# EAGLE design DIAGONAL POLYPHONIC SEQUENCER SIMPLER VERSION v12 for JLC PCB OP AMP VERSION (EAGLE 9.6.2)
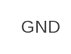
[diagram p0: schematic, sheet 1, part 1 of 2]
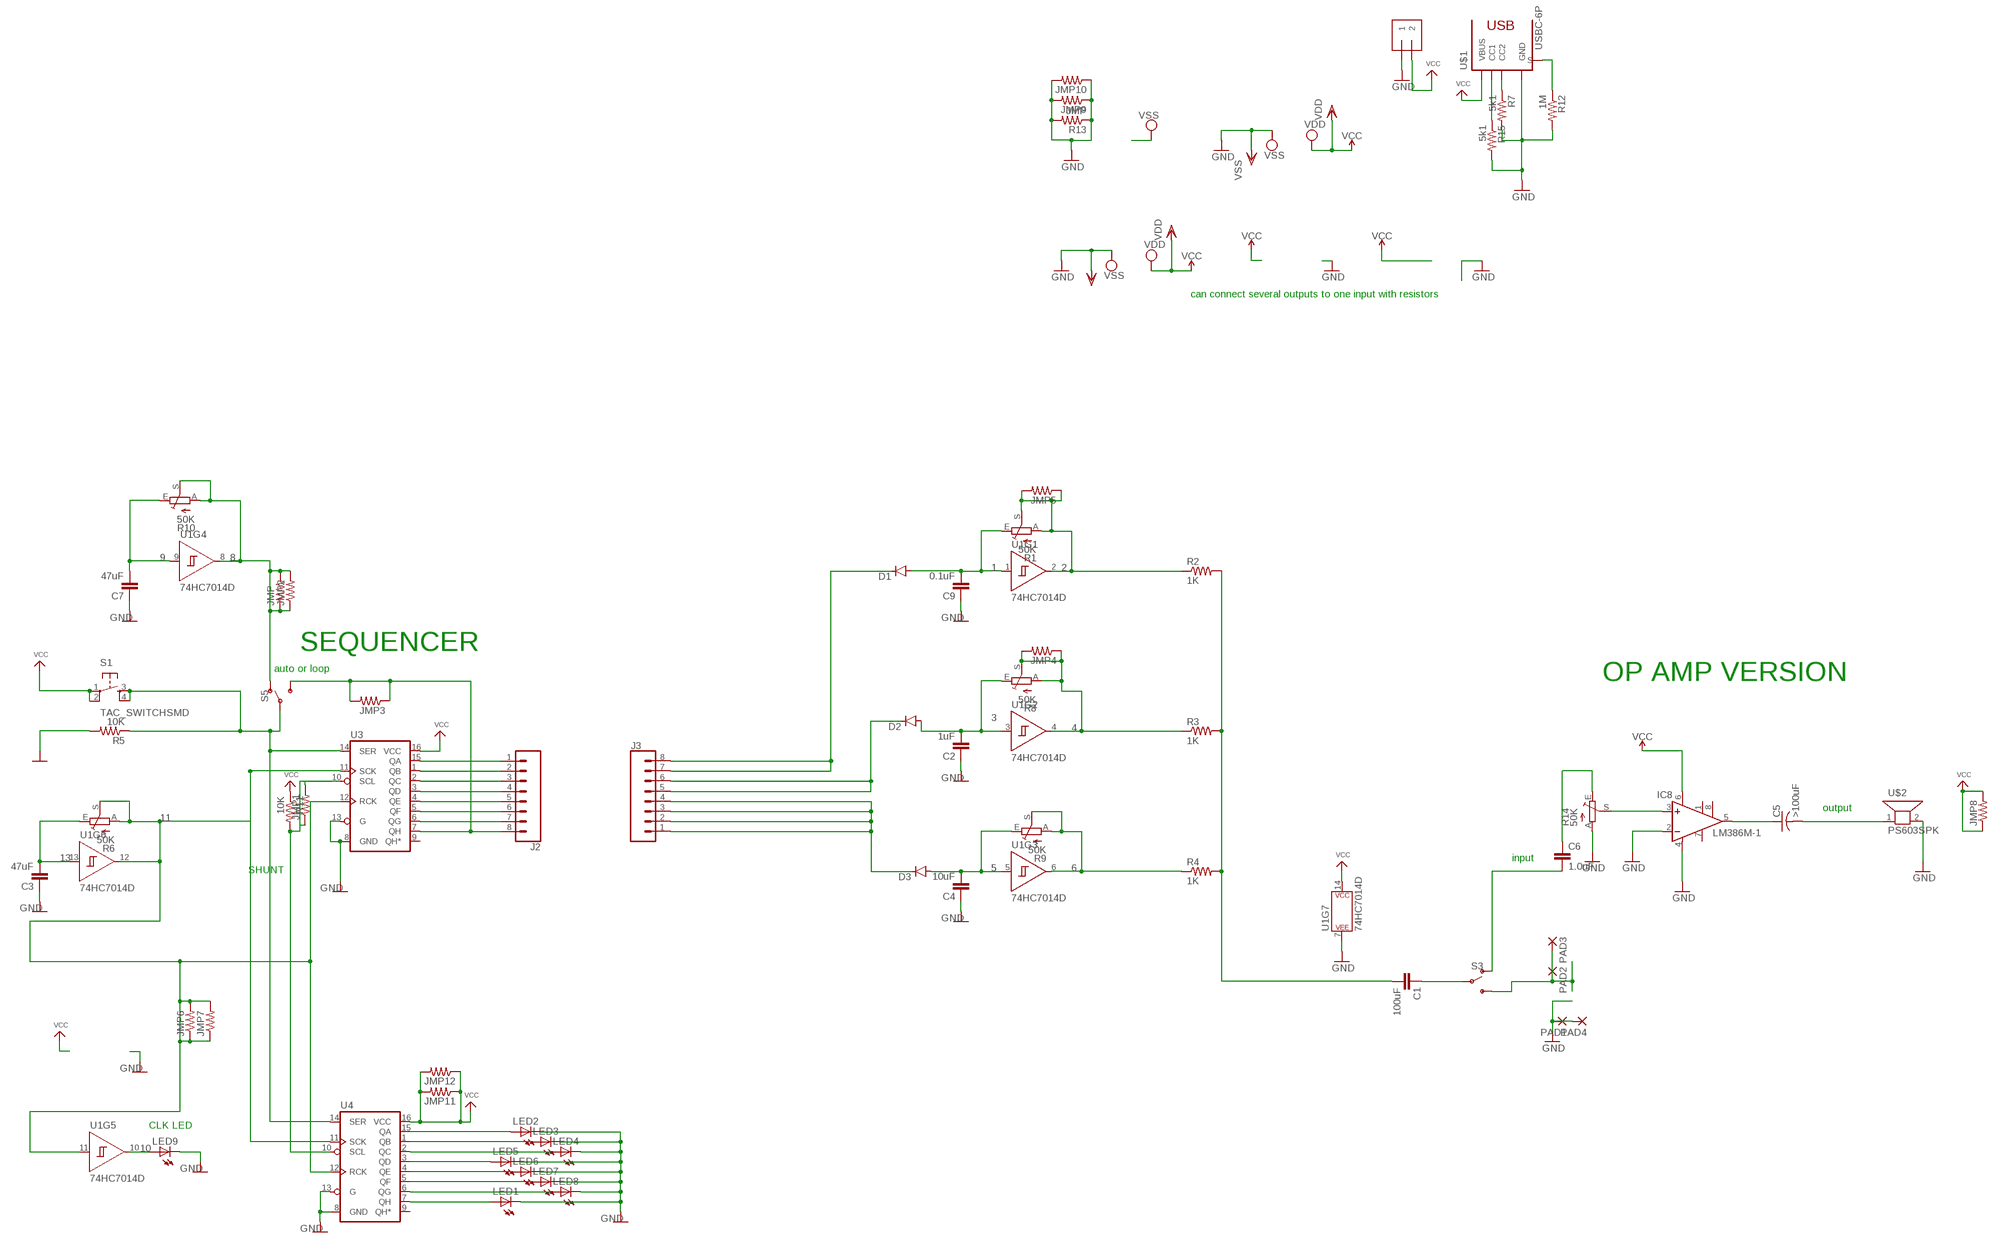
[diagram p1: schematic, sheet 1, part 2 of 2]

## Parts
C1  100uF  1.0UF-1206-50V-10%  [1206]
C2  1uF  1.0UF-1206-50V-10%  [1206]
C3  47uF  1.0UF-1206-50V-10%  [1206]
C4  10uF  1.0UF-1206-50V-10%  [1206]
C5  >100uF  C-USC1206  [C1206]
C6  1.0uF  1.0UF-1206-50V-10%  [1206]
C7  47uF  1.0UF-1206-50V-10%  [1206]
C9  0.1uF  1.0UF-1206-50V-10%  [1206]
D1  DIODEDO214AA  [DO-214AA]
D2  DIODEDO214AA  [DO-214AA]
D3  DIODEDO214AA  [DO-214AA]
IC8  LM386M-1  [SO08]
J1  1X2-3.5MM  [1X2-3.5MM]
J2  CONN_08SMD-STRAIGHT-ALT-FEMALE  [1X08_SMD_ALT]
J3  CONN_08SMD-STRAIGHT-ALT-FEMALE  [1X08_SMD_ALT]
JMP  R-US_R1206  [R1206]
JMP1  R-US_R1206  [R1206]
JMP2  R-US_R1206  [R1206]
JMP3  R-US_R1206  [R1206]
JMP4  R-US_R1206  [R1206]
JMP5  R-US_R1206  [R1206]
JMP6  R-US_R1206  [R1206]
JMP7  R-US_R1206  [R1206]
JMP8  R-US_R1206  [R1206]
JMP9  R-US_R1206  [R1206]
JMP10  R-US_R1206  [R1206]
JMP11  R-US_R1206  [R1206]
JMP12  R-US_R1206  [R1206]
LED1  LEDCHIPLED_1206  [CHIPLED_1206]
LED2  LEDCHIPLED_1206  [CHIPLED_1206]
LED3  LEDCHIPLED_1206  [CHIPLED_1206]
LED4  LEDCHIPLED_1206  [CHIPLED_1206]
LED5  LEDCHIPLED_1206  [CHIPLED_1206]
LED6  LEDCHIPLED_1206  [CHIPLED_1206]
LED7  LEDCHIPLED_1206  [CHIPLED_1206]
LED8  LEDCHIPLED_1206  [CHIPLED_1206]
LED9  LEDCHIPLED_1206  [CHIPLED_1206]
PAD1  SMD5  [SMD2,54-5,08]
PAD2  SMD5  [SMD2,54-5,08]
PAD3  SMD5  [SMD2,54-5,08]
PAD4  SMD5  [SMD2,54-5,08]
R1  50K  TRIM_EU-CA9V  [CA9V]
R2  1K  R-US_R1206  [R1206]
R3  1K  R-US_R1206  [R1206]
R4  1K  R-US_R1206  [R1206]
R5  10K  R-US_R1206  [R1206]
R6  50K  TRIM_EU-CA9V  [CA9V]
R7  5k1  R-US_R1206  [R1206]
R8  50K  TRIM_EU-CA9V  [CA9V]
R9  50K  TRIM_EU-CA9V  [CA9V]
R10  50K  TRIM_EU-CA9V  [CA9V]
R11  10K  R-US_R1206  [R1206]
R12  1M  R-US_R1206  [R1206]
R13  JMP  R-US_R1206  [R1206]
R14  50K  TRIM_EU-CA9V  [CA9V]
R15  5k1  R-US_R1206  [R1206]
S1  TAC_SWITCHSMD  [TACTILE-SWITCH-SMD]
S3  SWITCH-SPDT-SMD-AYZ0202  [SWITCH_DPDT_SMD_AYZ0202]
S5  SWITCH-SPDT-SMD-AYZ0202  [SWITCH_DPDT_SMD_AYZ0202]
U1  74HC7014D  [SO14]
U3  74595  [TSSOP16]
U4  74595  [TSSOP16]
U$1  USBC-6P  [USCX-06FX-XXMX-01]
U$2  PS603SPK  [PS603]

## Nets
1: C9.2 D1.A R1.E U1.1(A)
2: JMP5.1 JMP5.2 R1.A R1.S R2.1 U1.2(Y)
3: C2.2 D2.A R8.E U1.3(A)
4: JMP4.1 JMP4.2 R3.1 R8.A R8.S U1.4(Y)
5: C4.2 D3.A R9.E U1.5(A)
6: R4.1 R9.A R9.S U1.6(Y)
8: JMP2.1 JMP2.2 JMP.1 JMP.2 R10.A R10.S S5.1(O) U1.8(Y)
9: C7.2 R10.E U1.9(A)
10: LED9.A U1.10(Y)
11: JMP6.1 JMP6.2 JMP7.1 JMP7.2 R6.A R6.S U1.11(A) U1.12(Y) U3.11(SCK) U3.12(RCK) U4.11(SCK) U4.12(RCK)
13: C3.2 R6.E U1.13(A)
GND: C2.1 C3.1 C4.1 C7.1 C9.1 IC8.2(-IN) IC8.4(GND) J1.1 JMP9.1 JMP9.2 JMP10.1 JMP10.2 LED1.C LED2.C LED3.C LED4.C LED5.C LED6.C LED7.C LED8.C LED9.C PAD1.1(P) PAD4.1(P) R5.2 R7.2 R12.2 R13.1 R13.2 R14.A R15.2 U1.7(P$V-) U3.8(GND) U3.13(G) U4.8(GND) U4.13(G) U$1.GND1(GND) U$1.GND2(GND) U$2.2
N$1: LED1.A U4.7(QH)
N$2: C1.2 R2.2 R3.2 R4.2
N$3: LED4.A U4.2(QC)
N$4: R7.1 U$1.CC2
N$5: LED2.A U4.15(QA)
N$6: LED3.A U4.1(QB)
N$8: C1.1 S3.2(P)
N$9: J2.1 U3.15(QA)
N$10: J2.2 U3.1(QB)
N$11: LED7.A U4.5(QF)
N$12: LED6.A U4.4(QE)
N$13: LED8.A U4.6(QG)
N$14: LED5.A U4.3(QD)
N$15: D3.C J3.1 J3.2 J3.3 J3.4
N$16: D2.C J3.5 J3.6
N$17: R15.1 U$1.CC1
N$18: J2.3 U3.2(QC)
N$19: PAD2.1(P) PAD3.1(P) S3.3(S)
N$20: C6.2 S3.1(O)
N$21: J2.4 U3.3(QD)
N$22: R12.1 U$1.SHIELD1(S) U$1.SHIELD2(S) U$1.SHIELD3(S) U$1.SHIELD4(S)
N$24: D1.C J3.7 J3.8
N$25: J2.5 U3.4(QE)
N$26: J2.6 U3.5(QF)
N$27: J2.7 U3.6(QG)
N$28: J2.8 JMP3.1 JMP3.2 S5.3(S) U3.7(QH)
N$33: R5.1 S1.3 S1.4 S5.2(P) U3.14(SER) U4.14(SER)
N$45: JMP1.1 JMP1.2 R11.2 U3.10(SCL) U4.10(SCL)
N$99: IC8.3(+IN) R14.S
N$100: C5.1 IC8.5(OUT)
N$102: C5.2 U$2.1
N$103: C6.1 R14.E
VCC: IC8.6(VS) J1.2 JMP8.1 JMP8.2 JMP11.1 JMP11.2 JMP12.1 JMP12.2 R11.1 S1.1 S1.2 U1.14(P$V+) U3.16(VCC) U4.16(VCC) U$1.VBUS1(VBUS) U$1.VBUS2(VBUS)
Unconnected: IC8.1(GAIN) IC8.7(BYPASS) IC8.8(GAIN) U3.9(QH*) U4.9(QH*)

## Notes on the sheet
- can connect several outputs to one input with resistors
- SEQUENCER
- auto or loop
- OP AMP VERSION
- output
- input
- SHUNT
- CLK LED

## Library data of the parts
C1-C4 C7 C9 = SparkFun-Capacitors:1.0UF: 1µF ceramic capacitors A capacitor is a passive two-terminal electrical component used to store electrical energy temporarily in an electric field.; PROD_ID: CAP-09822; VALUE: 1.0uF
C5 = adafruit:C-US: CAPACITOR, American symbol
C6 = SparkFun-Capacitors:1.0UF: 1µF ceramic capacitors A capacitor is a passive two-terminal electrical component used to store electrical energy temporarily in an electric field.; PROD_ID: CAP-09822
D1-D3 = BeagleBone_Blue_R3:DIODE: Diode These are standard reverse protection diodes and small signal diodes. SMA package can handle up to about 1A. SOD-323 can handle about 200mA. What the SOD-323 package when ordering, there are some mfgs out there that are 5-pin packages.
IC8 = linear:LM386?-*: Low Voltage Audio Power Amplifier Source: http://cache.national.com/ds/LM/LM386.pdf
J1 = adafruit:1X2: 3.5mm Terminal block http://www.ladyada.net/library/pcb/eaglelibrary.html
J2 J3 = SparkFun-Connectors:CONN_08: Multi connection point. Often used as Generic Header-pin footprint for 0.1 inch spaced/style header connections On any of the 0.1 inch spaced packages, you can populate with these: Break Away Headers - Straight <https://www.sparkfun.com/products/116> (PRT-00116) Break Away Male Headers - Right Angle <https://www.sparkfun.com/products/553> (PRT-00553) Female Headers <https://www.sparkfun.com/products/115> (PRT-00115) Break Away Headers - Machine Pin <https://www.sparkfun.com/products/117> (PRT-00117) Break Away Female Headers - Swiss Machine Pin <https://www.sparkfun.com/products/743> (PRT-00743) Arduino Stackable Header - 8 Pin <https://www.sparkfun.com/products/9279> (PRT-09279) For SCREWTERMINALS and SPRING TERMINALS visit here: Screw Terimnals on SparkFun.com <https://www.sparkfun.com/search/results?term=Screw+Terminals> (5mm/3.5mm/2.54mm spacing) This device is also useful as a general connection point to wire up your design to another part of your project. Our various solder wires solder well into these plated through hole pads. Hook-Up Wire - Assortment (Stranded, 22 AWG) <https://www.sparkfun.com/products/11375> (PRT-11375) Hook-Up Wire - Assortment (Solid Core, 22 AWG) <https://www.sparkfun.com/products/11367> (PRT-11367) View the entire wire category on our website here <https://www.sparkfun.com/categories/141> Special notes: Molex polarized connector foot print use with SKU : PRT-08231 with associated crimp pins and housings. 1MM SMD Version SKU: PRT-10208 NOTES ON THE VARIANTS LOCK and LOCK_LONGPADS... This footprint was designed to help hold the alignment of a through-hole component (i.e. 6-pin header) while soldering it into place. You may notice that each hole has been shifted either up or down by 0.005 of an inch from it's more standard position (which is a perfectly straight line). This slight alteration caused the pins (the squares in the middle) to touch the edges of the holes. Because they are alternating, it causes a "brace" to hold the component in place. 0.005 has proven to be the perfect amount of "off-center" position when using our standard breakaway headers. Although looks a little odd when you look at the bare footprint, once you have a header in there, the alteration is very hard to notice. Also,if you push a header all the way into place, it is covered up entirely on the bottom side.; PROD_ID: CONN-10204; SF_ID: PRT-11543
JMP JMP1-JMP12 R2-R5 R7 R11-R13 R15 = adafruit:R-US_: RESISTOR, American symbol
LED1-LED9 = adafruit:LED: LED OSRAM: - CHIPLED LG R971, LG N971, LY N971, LG Q971, LY Q971, LO R971, LY R971 LH N974, LH R974 LS Q976, LO Q976, LY Q976 LO Q996 - Hyper CHIPLED LW Q18S LB Q993, LB Q99A, LB R99A - SideLED LS A670, LO A670, LY A670, LG A670, LP A670 LB A673, LV A673, LT A673, LW A673 LH A674 LY A675 LS A676, LA A676, LO A676, LY A676, LW A676 LS A679, LY A679, LG A679 - Hyper Micro SIDELED® LS Y876, LA Y876, LO Y876, LY Y876 LT Y87S - SmartLED LW L88C, LW L88S LB L89C, LB L89S, LG L890 LS L89K, LO L89K, LY L89K LS L896, LA L896, LO L896, LY L896 - TOPLED LS T670, LO T670, LY T670, LG T670, LP T670 LSG T670, LSP T670, LSY T670, LOP T670, LYG T670 LG T671, LOG T671, LSG T671 LB T673, LV T673, LT T673, LW T673 LH T674 LS T676, LA T676, LO T676, LY T676, LB T676, LH T676, LSB T676, LW T676 LB T67C, LV T67C, LT T67C, LS T67K, LO T67K, LY T67K, LW E67C LS E67B, LA E67B, LO E67B, LY E67B, LB E67C, LV E67C, LT E67C LW T67C LS T679, LY T679, LG T679 LS T770, LO T770, LY T770, LG T770, LP T770 LB T773, LV T773, LT T773, LW T773 LH T774 LS E675, LA E675, LY E675, LS T675 LS T776, LA T776, LO T776, LY T776, LB T776 LHGB T686 LT T68C, LB T68C - Hyper Mini TOPLED® LB M676 - Mini TOPLED Santana® LG M470 LS M47K, LO M47K, LY M47K Source: http://www.osram.convergy.de/
PAD1-PAD4 = wirepad:SMD5: SMD PAD
R1 R6 R8-R10 R14 = pot:TRIM_EU-: POTENTIOMETER
S1 = SparkFun-Retired:TAC_SWITCH: Momentary Switch Button commonly used for reset or general input. Spark Fun Electronics SKU : COM-00097 SMT- SWCH-08247; PROD_ID: SWCH-08247
S3 S5 = SparkFun-Switches:SWITCH-SPDT: Single Pole, Double Throw (SPDT) Switch Single-pole, double-throw (SPDT) switch. Variant Overview SMD-AYZ0202 Surface Mount DPDT Switch <https://www.sparkfun.com/products/597> (COM-00597) Used on e.g. LilyPad Arduino USB - ATmega32U4 Board <https://www.sparkfun.com/products/12049> PTH-11.6X4.0MM SPDT Mini Power Switch <https://www.sparkfun.com/products/102> (COM-00102) Used on e.g. SparkFun Simon Says - Through-Hole Soldering Kit <https://www.sparkfun.com/products/10547> (KIT-10547) PTH-11.6X4.0MM-KIT KIT version of SPDT Mini Power Switch - Simplifies soldering by removing tStop of switch pins - only one side can be soldered. PTH-11.6X4.0MM-LOCK LOCK version of SPDT Mini Power Switch - Offset pins hold switch in place for easier soldering. SMD-RIGHT-ANGLE Surface Mount Right Angle Switch <https://www.sparkfun.com/products/10860> (COM-10860) Used on e.g. SparkFun ESP8266 Thing <https://www.sparkfun.com/products/13231>; PROD_ID: SWCH-08179; SF_ID: COM-00597
U1 = SparkFun-IC-Logic:74*7014: Schmitt-trigger Hex Buffer The 74HC7014 is a hex buffer with precision Schmitt-trigger inputs. The precisely defined trigger levels are lying in a window between (0.55 x VCC) and (0.65 x VCC). It makes the circuit suitable to operate in a highly noisy environment. Input shorts are allowed to -1.5 V and +16 V without disturbing other channels. Inputs include clamp diodes that enable the use of current limiting resistors to interface inputs to voltages in excess of VCC. Schmitt trigger inputs transform slowly changing input signals into sharply defined jitter-free output signals. SparkFun Products SparkFun Stepoko <https://www.sparkfun.com/products/13899> (ROB-13899); PROD_ID: IC-12527
U3 U4 = SparkFun-IC-Logic:74*595: 8-Bit Shift Register (Serial to Parallel) Datasheet <http://cdn.sparkfun.com/datasheets/BreakoutBoards/MM74HC595.pdf> SparkFun Products SparkFun Shift Register Breakout - 74HC595 <https://www.sparkfun.com/products/10680> (BOB-10680)
U$1 = USBC6P:USBC-6P: AliExpress Special! Connect 5.1k 10% resistors to each CC pin, pulled up to 3.3v or 5.0v.
U$2 = adafruit:PS603: PS603 Small 8 ohm speaker, from Mouser. Can SMT solder to board http://www.ladyada.net/library/pcb/eaglelibrary.html

## Board
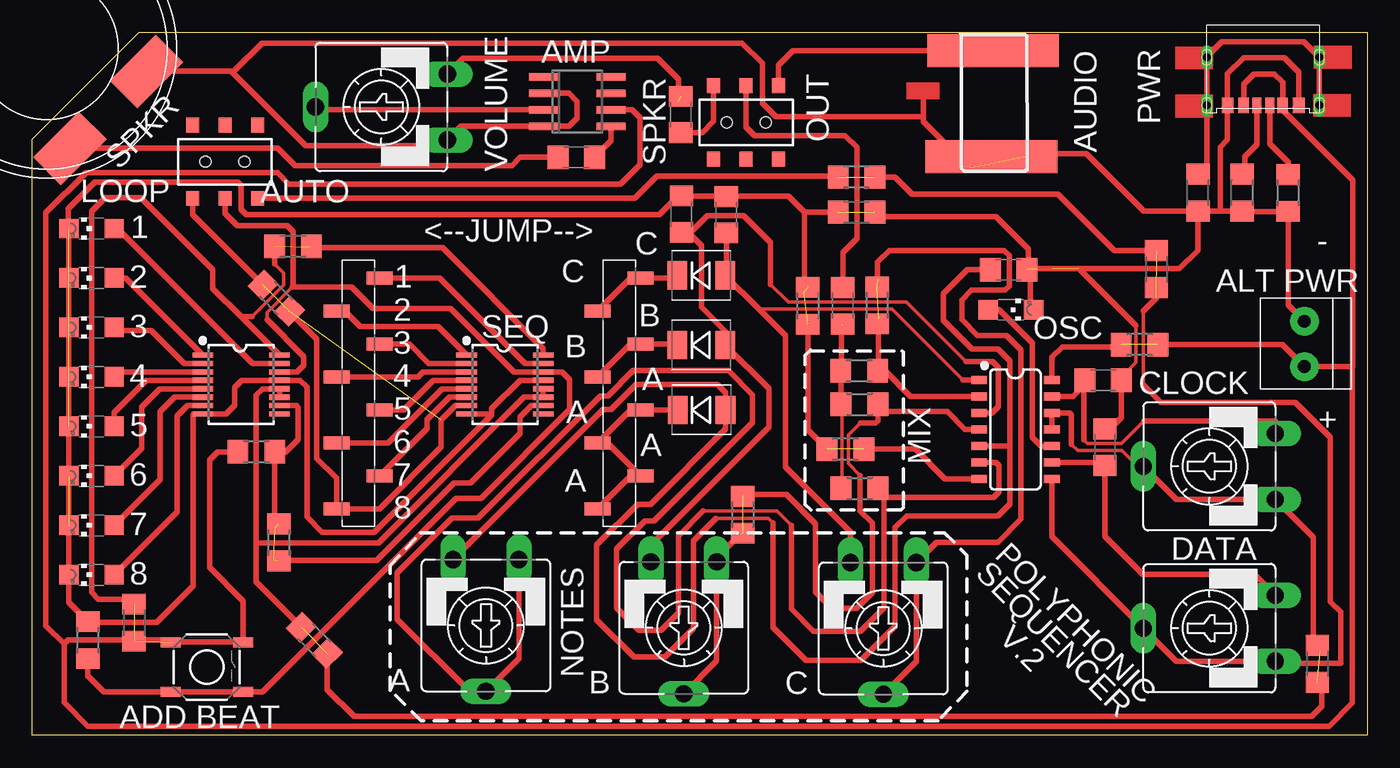
[diagram p2: board, top side]

Size 102.79 x 54.15 mm. Coordinates in mm from the lower left corner, seen from the top.
Outline: 0,45.95 8.2,54.15 8.25,54.15 102.79,54.15 102.79,0 0.03,0 0,0 0,45.95
Copper layers (1*16): Top 0.035mm / dielectric 0.2mm / Bottom 0.035mm
Design rules "JLC PCB DRU": minimum track width 3.5mil, minimum drill 0.2mm, track to track 3.5mil, track to pad 5mil, pad to pad 5mil, via to via 5mil, smd to smd 0mil, copper to edge 0.1mm, drill to drill 5mil, minimum pad ring 4mil, minimum via ring 4mil, stop-mask expansion 3mil, vias tented up to drill 100mil, thermal gap 10mil

### Footprints (pad centres in the part's own frame; a part is rotated, then mirrored left to right if it is on the bottom)
1206 = smd 1.6 x 1.8: 1 -1.4,0; 2 1.4,0
C1206 = smd 1.6 x 1.8: 1 -1.4,0; 2 1.4,0
DO-214AA = smd 1.524 x 2.184: A 1.841,0; C -1.841,0
SO08 = smd 0.6 x 2.2: 1 -1.905,-2.6; 2 -0.635,-2.6; 3 0.635,-2.6; 4 1.905,-2.6; 5 1.905,2.6; 6 0.635,2.6; 7 -0.635,2.6; 8 -1.905,2.6
1X2-3.5MM = drill 1 pad 2.184: 1 1.8,0; 2 -1.7,0
1X08_SMD_ALT = smd 1 x 2: 1 0,-1.65; 2 -2.54,1.65; 3 -5.08,-1.65; 4 -7.62,1.65; 5 -10.16,-1.65; 6 -12.7,1.65; 7 -15.24,-1.65; 8 -17.78,1.65
R1206 = smd 1.6 x 1.803: 1 -1.422,0; 2 1.422,0
CHIPLED_1206 = smd 1.5 x 1.5: A 0,-1.75; C 0,1.75
SMD2,54-5,08 = smd 2.54 x 5.08: 1 0,0
CA9V = drill 1.321 long: A -2.54,-5.08; E 2.54,-5.08; S 0,5.08
TACTILE-SWITCH-SMD = smd 1.524 x 0.762: 1 -2.794,1.905; 2 2.794,1.905; 3 -2.794,-1.905; 4 2.794,-1.905
SWITCH_DPDT_SMD_AYZ0202 = smd 1 x 1.15: 1 -2.5,2.825; 2 0,2.825; 3 2.5,2.825; 4 -2.5,-2.825; 5 0,-2.825; 6 2.5,-2.825 | hole 0.85: 1.5,0; -1.5,0
SO14 = smd 0.6 x 1.2: 1 -3.175,-2.8; 2 -1.905,-2.8; 3 -0.635,-2.8; 4 0.635,-2.8; 5 1.905,-2.8; 6 3.175,-2.8; 7 4.445,-2.8; 8 4.445,2.8; 9 3.175,2.8; 10 1.905,2.8; 11 0.635,2.8; 12 -0.635,2.8; 13 -1.905,2.8; 14 -3.175,2.8
TSSOP16 = smd 0.4 x 1.6: 1 -2.225,-2.85; 2 -1.575,-2.85; 3 -0.925,-2.85; 4 -0.275,-2.85; 5 0.375,-2.85; 6 1.025,-2.85; 7 1.675,-2.85; 8 2.325,-2.85; 9 2.325,3.05; 10 1.675,3.05; 11 1.025,3.05; 12 0.375,3.05; 13 -0.275,3.05; 14 -0.925,3.05; 15 -1.575,3.05; 16 -2.225,3.05
USCX-06FX-XXMX-01 = smd 0.7 x 1.2: CC1 0.5,-1.75; CC2 -0.5,-1.75 | smd 0.9 x 1.2: GND1 2.75,-1.75; GND2 -2.75,-1.75 | drill 0.6 long: SHIELD1 4.325,1.95; SHIELD2 4.325,-1.75; SHIELD3 -4.35,-1.75; SHIELD4 -4.35,1.95 | smd 0.8 x 1.2: VBUS1 1.5,-1.75; VBUS2 -1.5,-1.75
PS603 = smd 5 x 3: 1 -4.184,-6.738; 2 4.184,-6.738

### Placement (x,y rotation side)
C1  62.41,33.1 270 top
C2  49.99,40.16 270 top
C3  82.47,27.37 180 top
C4  75.18,35.86 180 top
C5  41.88,44.53 180 top
C6  49.94,47.83 270 top
C7  82.6,22.2 270 top
C9  53.44,40.11 270 top
D1  51.51,35.43 0 top
D2  51.51,30.07 0 top
D3  51.54,25.07 0 top
IC8  41.96,48.82 270 top
J1  97.97,30.1 90 top
J2  25.1,35.23 90 top
J3  45.19,17.45 270 top
JMP  63.47,43 0 top
JMP1  18.97,14.86 90 top
JMP2  86.56,35.92 90 top
JMP3  18.78,33.69 135 top
JMP4  54.71,16.99 90 top
JMP5  65.05,33.12 90 top
JMP6  21.7,7.32 135 top
JMP7  98.96,5.51 90 top
JMP8  85.27,30.1 0 top
JMP9  59.72,33.1 90 top
JMP10  62.61,22.05 0 top
JMP11  20.07,37.67 0 top
JMP12  7.82,8.69 90 top
LED1  4.55,12.37 90 top
LED2  4.55,39.04 90 top
LED3  4.55,35.23 90 top
LED4  4.55,31.42 90 top
LED5  4.55,27.61 90 top
LED6  4.55,23.8 90 top
LED7  4.55,19.99 90 top
LED8  4.55,16.18 90 top
LED9  75.36,32.79 270 top
PAD1  76.4,44.6 90 top
PAD2  76.5,52.73 90 top
PAD3  71.48,52.73 90 top
PAD4  71.32,44.6 270 top
R1  65.53,8.23 180 top
R2  63.68,28.09 180 top
R3  63.7,25.5 180 top
R4  63.7,19.02 180 top
R5  4.27,7.34 90 top
R6  90.65,20.73 90 top
R7  93.17,41.81 270 top
R8  50.16,8.28 180 top
R9  34.93,8.46 180 top
R10  90.65,8.26 90 top
R11  17.25,21.84 0 top
R12  89.76,41.81 270 top
R13  63.47,40.31 180 top
R14  26.87,48.41 90 top
R15  96.72,41.78 270 top
S1  13.44,5.26 0 top
S3  54.97,47.22 0 top
S5  14.83,44.2 180 top
U1  75.72,24.21 270 top
U3  36.3,27.08 270 top
U4  15.98,27.08 270 top
U$1  94.79,50.29 0 top
U$2  1.07,52.96 45 top

### Tracks (layer width: path | path; a pad name or v marks a point on that pad's centre or on a via)
1  (1 unrouted)
  Top 0.254: 66.22,32.84 55.94,32.84 | 71.67,27.38 66.22,32.84
  Top 0.406: R1.E 62.99,15.67 57.99,20.68 57.99,30.8 55.94,32.84 D1.A 53.44,35.52 C9.2 | U1.1 71.67,27.38
2  (2 unrouted)
  Top 0.406: R1.S 68.07,5.69 R1.A 69.62,14.86 74.35,14.86 76.15,16.66 76.15,29.67 75.01,30.81 72.8,30.81 71.58,32.03 71.58,33.53 72.34,34.29 74.9,34.29 75.23,34.62 75.23,36.96 74.83,37.36 65.99,37.36 65.07,36.45 65.07,35.15 | 65.15,31.67 65.15,28.09 R2.1 65.65,28.09 67.63,26.11 U1.2 | 65.15,31.67 65.15,31.98 65.2,32.03 | JMP5.1 65.13,31.7 65.15,31.67
3
  Top 0.254: 71.88,28.8 67.31,33.38 58.22,33.38 56.85,34.75
  Top 0.406: R8.E 47.62,11.94 47.73,11.84 47.73,14.76 56.72,23.75 56.72,26.71 D2.A 53.35,31.17 51.54,32.98 51.54,37.72 50.67,38.58 50.16,38.58 | 50.16,38.58 50.34,38.4 51.99,40.06 54.76,40.06 56.85,37.97 56.85,34.75 | 50.16,38.58 C2.2 | 71.88,28.8 73.94,28.8 74.4,28.35 74.4,25.35 73.89,24.84 U1.3
4  (3 unrouted)
  Top 0.254: 63.75,20.04 62.86,20.93 62.86,23.14 63.78,24.05
  Top 0.406: R8.S 52.7,5.74 R8.A 52.7,13.67 54.51,15.47 | R3.1 65.68,24.94 70.46,24.94 71.83,23.57 U1.4 | R3.1 64.64,25.5 | 54.66,18.54 58.09,18.54 60.32,16.31 60.32,11.05 61.59,9.78 63.47,9.78 64.69,11 64.69,16.36 63.75,17.3 63.75,20.04 | R3.1 65.13,24.23 64.95,24.05 63.78,24.05
5
  Top 0.254: 52.65,16.71 56.69,16.71 57.05,16.36
  Top 0.406: 52.65,16.71 50.9,14.96 50.9,8.23 48.72,6.05 46.33,6.05 43.46,8.92 43.46,14.66 46.61,17.81 47.6,17.81 53.38,23.58 D3.A 53.38,26.43 52.78,27.03 46.51,27.03 44.58,25.1 43.94,25.1 R9.E | 57.05,16.36 57.05,8.31 59.56,5.79 63.8,5.79 66.42,8.41 66.42,16 67.34,16.92 74.37,16.92 75.29,17.83 75.29,22.28 | C4.2 72.01,35.86 70.18,34.04 70.18,31.95 72.36,29.77 74.35,29.77 75.29,28.83 75.29,22.28 | 75.29,22.28 72.94,22.28 U1.5
6
  Top 0.254: 58.45,16.18 57.35,17.27 51.66,17.27
  Top 0.406: R9.A 37.46,5.92 R9.S 33.65,3.38 28.09,8.94 28.09,12.52 32.33,16.76 34.34,16.76 43.74,26.16 44.32,26.16 46.25,28.09 53.59,28.09 55.45,26.24 55.45,24.1 47.88,16.54 47.17,16.54 44.98,14.35 44.98,9.83 46.74,8.08 48.41,8.08 49.76,9.42 49.76,15.37 51.66,17.27 | 58.45,16.18 58.45,9.73 60.17,8 63.78,8 65.58,9.8 65.58,19.02 R4.1 65.84,18.31 74.02,18.31 74.45,18.75 74.45,20.78 74.19,21.03 U1.6
8  (4 unrouted)
  Top 0.254: 85.55,32.69 85.55,28.4 | 85.55,27.01 85.55,28.4
  Top 0.406: R10.S 88.11,5.72 R10.A 95.88,5.56 100.76,5.56 100.76,9.5 99.97,10.29 99.97,22.94 97.26,25.65 86.91,25.65 85.55,27.01 | 85.01,8.89 85.01,8.81 R10.S | 61.75,43.31 JMP.1 61.98,43.08 48.11,43.08 46.4,41.37 S5.1 | JMP.2 66.42,43 67.74,41.68 78.97,41.68 83.31,37.34 JMP2.2 | 86.61,37.57 86.61,37.16 | JMP2.1 86.56,33.71 85.55,32.69 | U1.8 78.52,15.31 R10.S
9
  Top 0.406: R10.E 94.13,12.4 85.52,12.4 82.6,15.32 C7.2 82.37,21.03 U1.9
10
  Top 0.406: LED9.A 74.45,32.79 77.01,30.23 77.01,22.94 77.7,22.25 78.47,22.25 U1.10
11  (3 unrouted)
  Top 0.254: 85.14,20.73 83.92,21.95 80.52,21.95 80.04,22.43
  Top 0.406: U3.12 U3.11 37.86,26.05 26.64,14.83 17.35,14.83 17.25,14.94 | 17.25,14.94 17.25,26.21 17.74,26.7 U4.12 U4.11 | 85.14,20.73 R6.S 88.11,18.19 R6.A 98.65,15.27 98.65,7.24 JMP7.2 99.19,6.71 99.19,6.48 | 17.25,14.94 17.25,11.81 20.9,8.15 | JMP6.1 22.71,3.52 24.78,1.45 98.53,1.45 99.31,2.24 99.31,3.73 JMP7.1 | 80.04,22.43 80.04,24.66 79.86,24.84 U1.12 U1.11
13
  Top 0.254: 80.98,22.76 81.25,22.48 83.87,22.48 85.6,24.21
  Top 0.406: 80.98,22.76 80.98,27.27 C3.2 81.07,27.06 80.12,26.11 U1.13 | 85.6,24.21 95.73,24.21 R6.E
GND  (11 unrouted)
  Top 0.254: 84.99,31.57 84.99,28.74 83.87,27.62
  Top 0.406: U3.8 35.36,24.75 | 35.36,24.75 35.36,25.17 37.54,27.36 U3.13 | U$1.GND1 97.54,51.1 96.42,52.22 93.29,52.22 92.04,50.97 U$1.GND2 92.04,45.88 91.48,45.32 91.48,40.39 | R12.2 91.48,40.39 | 91.48,40.39 R7.2 93.19,40.36 R15.2 96.72,33.14 J1.1 | 35.36,24.75 35.36,24.69 26.31,15.65 22.33,15.65 21.16,16.81 21.16,26.82 20.63,27.35 U4.13 16.12,27.35 15.57,26.8 15.57,25.4 14.92,24.75 U4.8 12.41,24.75 12.37,24.71 12.37,11.51 9.55,8.69 4.34,8.69 R5.2 4.27,8.79 2.8,10.26 LED1.C LED8.C LED2.C 2.77,39.07 2.77,40.59 4.8,42.62 15.82,42.62 16.08,42.37 16.08,40.51 16.45,40.14 48.29,40.14 49.71,41.56 C2.1 | C2.1 53.39,41.56 | 53.39,41.56 53.64,41.56 53.67,41.53 58.24,41.53 59.46,40.31 | 53.39,41.56 C9.1 | C7.1 82.98,23.6 83.87,24.49 C3.1 83.87,27.62 | PAD4.1 73.15,44.6 73.36,44.81 81.18,44.81 85.6,40.39 R12.2 | 84.99,31.57 80.59,35.97 | R12.2 89.76,37.36 88.34,35.94 76.66,35.94 C4.1 76.71,35.74 | PAD4.1 72.19,43.74 | R13.1 65.25,39.95 74.22,39.95 76.71,37.46 76.71,35.74 | 50.06,41.63 C2.1 | LED9.C 76.86,33.05 76.86,35.59 76.71,35.74 | R13.2 59.46,40.31 | 59.46,40.31 59.46,34.16 59.44,34.14 | JMP10.1 59.72,23.52 JMP9.1 | U1.7 70.28,19.76 68,22.05 JMP10.2 | PAD4.1 68.63,47.29 68.63,47.63 | 68.63,47.63 68.63,49.43 | U$2.2 15.32,51.15 | 15.32,51.15 21.06,45.42 31.5,45.42 R14.A 32.99,46.91 IC8.4 41.33,46.91 41.96,47.55 41.96,48.82 41.33,49.45 IC8.2 | 15.32,51.15 15.52,51.15 17.7,53.34 54.66,53.34 56.24,51.77 56.24,48.72 57.28,47.68 68.58,47.68 68.63,47.63
N$1
  Top 0.406: LED1.A 11.15,17.22 11.15,24.61 11.94,25.4 U4.7
N$2  (1 unrouted)
  Top 0.254: 62.36,25.43 62.36,19.1
  Top 0.406: 62.36,25.43 R3.2 62.26,25.53 R2.2 62.31,28.14 62.31,31.6 | 62.36,19.1 R4.2
N$3
  Top 0.406: U4.2 11.68,28.65 9.14,31.19 6.52,31.19 LED4.A
N$4
  Top 0.406: U$1.CC2 94.32,48.52 94.32,45.52 93.4,44.6 93.4,43.46 R7.1
N$5
  Top 0.406: U4.15 16.94,28.65 6.55,39.04 LED2.A
N$6
  Top 0.406: LED3.A 7.2,35.23 U4.1
N$8
  Top 0.406: C1.1 62.41,37.19 63.49,38.27 63.49,45.3 62.59,46.2 55.63,46.2 54.97,46.86 S3.2
N$9
  Top 0.406: U3.15 37.95,28.65 31.37,35.23 J2.1
N$10
  Top 0.406: J2.2 24.05,32.69 25.25,31.5 31.25,31.5 U3.1
N$11
  Top 0.406: LED7.A 8.41,22.1 8.41,25.3 9.8,26.7 U4.5
N$12
  Top 0.406: U4.4 8.76,27.35 6.3,24.89 LED6.A
N$13
  Top 0.406: LED8.A 9.83,19.71 9.83,24.94 10.94,26.05 U4.6
N$14
  Top 0.406: U4.3 6.69,28 LED5.A
N$15
  Top 0.406: D3.C J3.4 46.08,25.07 J3.3 44.3,22.53 J3.2 46.08,19.99 J3.1
N$16
  Top 0.406: J3.5 46.08,30.15 J3.6 49.59,30.15 D2.C
N$17
  Top 0.406: R15.1 96.72,44.17 95.32,45.58 95.32,48.52 U$1.CC1
N$18
  Top 0.406: J2.3 29.03,30.15 30.53,28.65 U3.2
N$19
  Top 0.406: PAD2.1 PAD3.1 58.58,52.73 57.47,51.61 S3.3
N$20
  Top 0.406: C6.2 51.59,46.43 52.47,47.3 S3.1
N$21
  Top 0.406: J2.4 29.69,27.61 30.08,28 U3.3
N$22
  Top 0.406: R12.1 90.47,43.94 90.47,48.52 U$1.SHIELD3 U$1.SHIELD4 90.44,52.29 91.59,53.44 97.92,53.44 U$1.SHIELD1 U$1.SHIELD2
N$23
  Top 0.406: 20.09,32.26 20.17,32.26 21.89,30.53 21.89,21.34 23.42,19.81 23.42,17.45
N$24
  Top 0.406: D1.C 49.47,35.23 J3.8 46.08,35.23 J3.7
N$25
  Top 0.406: J2.5 28.57,25.07 30.86,27.35 U3.4
N$26
  Top 0.406: J2.6 27.38,22.53 31.55,26.7 U3.5
N$27
  Top 0.406: J2.7 30.4,23.65 30.4,24.34 32.11,26.05 U3.6
N$28  (2 unrouted)
  Top 0.406: J2.8 26.72,17.45 31.47,22.2 31.47,24.28 32.59,25.4 U3.7 | S5.3 12.33,40.14 JMP3.2
N$33
  Top 0.254: 18.06,32.03 18.06,32.59 20.02,34.54 20.07,34.59
  Top 0.406: U4.14 20.4,28 20.91,28.51 20.91,29.18 18.06,32.03 | 20.07,34.59 20.07,38.81 19.61,39.27 15.75,39.27 14.83,40.18 S5.2 | R5.1 4.27,4.57 5.49,3.35 S1.3 S1.4 17.73,3.35 32.64,18.26 34.54,18.26 41.38,25.1 41.38,27.43 40.81,28 U3.14 37.1,28 32.21,32.89 26.24,32.89 24.59,34.54 20.02,34.54
N$45  (3 unrouted)
  Top 0.406: U4.10 20.35,25.4 20.47,25.27 20.47,22.81 19.51,21.84 R11.2 18.67,16.59 JMP1.2 | U3.10 38.84,25.4 38.43,25.4 37.57,24.54 37.57,23.27 33.76,19.46 32.49,19.46 26.52,13.49 18.59,13.49 | 18.67,15.98 18.69,15.95
N$99
  Top 0.406: IC8.3 22,48.18 21.79,48.39 R14.S
N$100
  Top 0.406: C5.1 44.56,45.8 IC8.5
N$102
  Top 0.406: U$2.1 18.89,45.25 20.24,43.89 36.93,43.89 37.57,44.53 C5.2
N$103  (1 unrouted)
  Top 0.406: R14.E 33.17,52.17 48.13,52.17 49.76,50.55 49.76,48.82
VCC  (6 unrouted)
  Top 0.254: 16.94,32.25 19.35,34.67 19.35,35.61 18.64,36.32
  Top 0.406: U$1.VBUS2 93.29,50.16 94.08,50.95 95.66,50.95 96.29,50.32 U$1.VBUS1 96.29,48.16 101.68,42.77 101.68,28.4 101.07,28.4 | R11.1 14.28,21.84 13.64,21.21 13.64,12.93 16.23,10.34 S1.2 | 16.31,7.21 10.69,7.21 S1.1 10.46,7.34 2.74,7.34 2.44,7.04 | 101.07,28.4 J1.2 96.27,30.1 | 101.07,28.4 101.65,28.4 101.65,2.49 99.87,0.71 4.27,0.71 2.44,2.54 2.44,7.04 | 96.24,30.12 96.27,30.1 | JMP8.1 83.68,29.93 79.32,29.93 78.52,29.13 U1.14 | JMP8.2 96.27,30.1 | U3.16 39.35,29.82 31.6,37.57 21.26,37.57 | U4.16 16.07,32.25 | 16.07,32.25 13.89,34.43 13.89,35.86 8.33,41.43 5.59,41.43 4.55,40.39 4.55,11 5.08,10.46 7.47,10.46 JMP12.2 | 16.07,32.25 16.94,32.25 | 18.64,36.32 JMP11.1 | 2.44,7.04 1.04,8.43 1.04,40.26 4.14,43.36 18.87,43.36 19.75,42.48 45.3,42.48 46.79,43.97 46.79,47.57 46.18,48.18 IC8.6
(copper drawn outside any net)
  shapes: Top area x5

### Text on the board
tNames: AMP | PWR | SPKR | OUT | AUDIO | SPKR | LOOP | AUTO | VOLUME | 1 | <--JUMP--> | C | C | - | 2 | 1 | ALT PWR | 2 | B | 3 | OSC | 3 | SEQ | B | 4 | 4 | A | CLOCK | 5 | A | 5 | MIX | 6 | A | + | 6 | 7 | A | 8 | 7 | POLYPHONIC | 8 | NOTES | DATA | SEQUENCER | V.2 | A | B | C | ADD BEAT